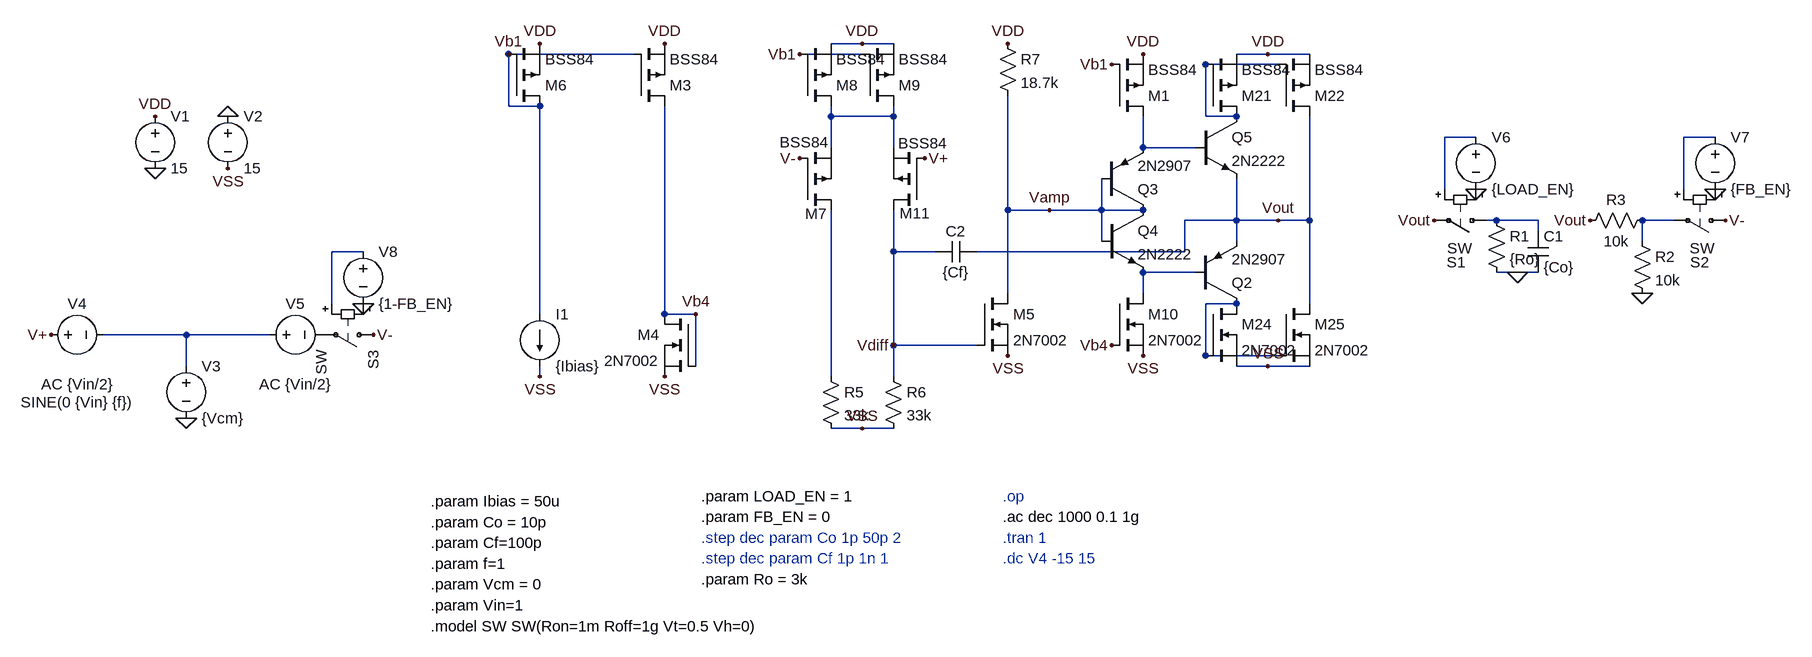
[diagram p0: schematic OpAmp_Project.asc]
OpAmp_Project.asc, the LTspice schematic file:
Version 4
SHEET 1 1828 856
WIRE 384 -64 336 -64
WIRE 432 -64 384 -64
WIRE 32 -48 -160 -48
WIRE 384 -48 288 -48
WIRE 1008 -48 960 -48
WIRE 1072 -48 1008 -48
WIRE 1024 -32 912 -32
WIRE -160 32 -160 -48
WIRE -112 32 -160 32
WIRE 336 48 336 32
WIRE 432 48 432 32
WIRE 432 48 336 48
WIRE 912 48 912 -32
WIRE 960 48 912 48
WIRE 1328 80 1280 80
WIRE 1696 80 1648 80
WIRE 336 96 336 48
WIRE 432 96 432 48
WIRE 816 96 816 48
WIRE 896 96 816 96
WIRE 1280 160 1280 80
WIRE 1648 160 1648 80
WIRE 608 192 608 16
WIRE 672 192 608 192
WIRE 752 192 752 144
WIRE 752 192 672 192
WIRE 816 192 752 192
WIRE 960 208 960 144
WIRE 960 208 880 208
WIRE 1024 208 960 208
WIRE 1072 208 1072 48
WIRE 1072 208 1024 208
WIRE 1360 208 1344 208
WIRE 1424 208 1360 208
WIRE 1632 208 1584 208
WIRE 1424 224 1424 208
WIRE 752 240 752 192
WIRE 960 240 960 208
WIRE 1584 240 1584 208
WIRE -384 256 -432 256
WIRE 432 256 432 192
WIRE 496 256 432 256
WIRE 880 256 880 208
WIRE 880 256 560 256
WIRE 896 288 816 288
WIRE 1392 288 1360 288
WIRE 1424 288 1392 288
WIRE 608 320 608 192
WIRE 816 320 816 288
WIRE -432 336 -432 256
WIRE 960 336 912 336
WIRE 1072 336 1072 208
WIRE -112 352 -112 32
WIRE 80 352 80 32
WIRE 128 352 80 352
WIRE -656 384 -784 384
WIRE -528 384 -656 384
WIRE 432 400 432 256
WIRE 560 400 432 400
WIRE 912 416 912 336
WIRE 1024 416 912 416
WIRE -656 432 -656 384
WIRE 128 432 128 352
WIRE 1008 432 960 432
WIRE 1072 432 1008 432
WIRE -112 448 -112 432
WIRE 336 448 336 192
WIRE 432 448 432 400
WIRE 384 528 336 528
WIRE 432 528 384 528
FLAG -704 128 0
FLAG -704 48 VDD
FLAG -112 -64 VDD
FLAG 384 -64 VDD
FLAG -592 48 0
FLAG -592 128 VSS
FLAG -112 448 VSS
FLAG -864 384 V+
FLAG -656 512 0
FLAG 1008 432 VSS
FLAG 1008 -48 VDD
FLAG 1392 288 0
FLAG 1584 320 0
FLAG 80 448 VSS
FLAG 80 -64 VDD
FLAG -160 -48 Vb1
FLAG 128 352 Vb4
FLAG 816 -48 VDD
FLAG 1024 208 Vout
FLAG 816 416 VSS
FLAG 768 400 Vb4
FLAG 1712 208 V-
FLAG 288 112 V-
FLAG 480 112 V+
FLAG 768 -32 Vb1
FLAG 288 -48 Vb1
FLAG 384 528 VSS
FLAG 608 416 VSS
FLAG 608 -64 VDD
FLAG 432 400 Vdiff
FLAG 672 192 Vamp
FLAG -368 384 V-
FLAG 1264 208 Vout
FLAG -384 336 0
FLAG 1328 160 0
FLAG 1696 160 0
FLAG 1504 208 Vout
SYMBOL current -112 352 R0
WINDOW 123 0 0 Left 0
WINDOW 39 0 0 Left 0
SYMATTR InstName I1
SYMATTR Value {Ibias}
SYMBOL pmos -160 32 M180
SYMATTR InstName M6
SYMATTR Value BSS84
SYMBOL voltage -704 32 R0
WINDOW 123 24 124 Left 2
WINDOW 39 0 0 Left 0
SYMATTR InstName V1
SYMATTR Value 15
SYMBOL pmos 288 32 M180
SYMATTR InstName M8
SYMATTR Value BSS84
SYMBOL pmos 384 32 M180
SYMATTR InstName M9
SYMATTR Value BSS84
SYMBOL voltage -592 32 R0
WINDOW 123 24 124 Left 2
WINDOW 39 0 0 Left 0
SYMATTR InstName V2
SYMATTR Value 15
SYMBOL voltage -656 416 R0
WINDOW 123 24 124 Left 2
WINDOW 39 0 0 Left 0
SYMATTR InstName V3
SYMATTR Value {Vcm}
SYMBOL voltage -880 384 R270
WINDOW 0 32 56 VTop 2
WINDOW 3 -88 56 VBottom 2
WINDOW 123 -60 56 VBottom 2
WINDOW 39 0 0 Left 0
SYMATTR InstName V4
SYMATTR Value SINE(0 {Vin} {f})
SYMATTR Value2 AC {Vin/2}
SYMBOL pnp 896 336 M180
SYMATTR InstName Q2
SYMATTR Value 2N2907
SYMBOL pnp 752 192 M180
SYMATTR InstName Q3
SYMATTR Value 2N2907
SYMBOL npn 752 192 R0
SYMATTR InstName Q4
SYMATTR Value 2N2222
SYMBOL npn 896 48 R0
SYMATTR InstName Q5
SYMATTR Value 2N2222
SYMBOL res 1344 192 R0
SYMATTR InstName R1
SYMATTR Value {Ro}
SYMBOL pmos 912 48 M180
SYMATTR InstName M21
SYMATTR Value BSS84
SYMBOL pmos 1024 48 M180
SYMATTR InstName M22
SYMATTR Value BSS84
SYMBOL nmos 912 336 R0
SYMATTR InstName M24
SYMATTR Value 2N7002
SYMBOL nmos 1024 336 R0
SYMATTR InstName M25
SYMATTR Value 2N7002
SYMBOL cap 1408 224 R0
SYMATTR InstName C1
SYMATTR Value {Co}
SYMBOL res 1568 224 R0
SYMATTR InstName R2
SYMATTR Value 10k
SYMBOL res 1600 192 R90
WINDOW 0 0 56 VBottom 2
WINDOW 3 32 56 VTop 2
SYMATTR InstName R3
SYMATTR Value 10k
SYMBOL pmos 32 32 M180
SYMATTR InstName M3
SYMATTR Value BSS84
SYMBOL nmos 128 352 M0
SYMATTR InstName M4
SYMATTR Value 2N7002
SYMBOL voltage -544 384 R270
WINDOW 0 32 56 VTop 2
WINDOW 3 -88 56 VBottom 2
WINDOW 123 -60 56 VBottom 2
WINDOW 39 0 0 Left 0
SYMATTR InstName V5
SYMATTR Value ""
SYMATTR Value2 AC {Vin/2}
SYMBOL nmos 768 320 R0
SYMATTR InstName M10
SYMATTR Value 2N7002
SYMBOL pmos 768 48 M180
SYMATTR InstName M1
SYMATTR Value BSS84
SYMBOL nmos 560 320 R0
SYMATTR InstName M5
SYMATTR Value 2N7002
SYMBOL res 320 432 R0
SYMATTR InstName R5
SYMATTR Value 33k
SYMBOL res 416 432 R0
SYMATTR InstName R6
SYMATTR Value 33k
SYMBOL res 592 -80 R0
SYMATTR InstName R7
SYMATTR Value 18.7k
SYMBOL pmos 288 192 M180
WINDOW 0 8 -6 Left 2
WINDOW 3 151 103 Left 2
SYMATTR InstName M7
SYMATTR Value BSS84
SYMBOL pmos 480 192 R180
WINDOW 0 -9 -5 Left 2
WINDOW 3 149 104 Left 2
SYMATTR InstName M11
SYMATTR Value BSS84
SYMBOL cap 560 240 R90
WINDOW 0 0 32 VBottom 2
WINDOW 3 32 32 VTop 2
SYMATTR InstName C2
SYMATTR Value {Cf}
SYMBOL sw 1360 208 R90
WINDOW 0 64 77 VLeft 2
WINDOW 3 43 76 VLeft 2
SYMATTR InstName S1
SYMBOL sw 1728 208 R90
WINDOW 0 64 70 VLeft 2
WINDOW 3 43 71 VLeft 2
SYMATTR InstName S2
SYMBOL voltage 1328 64 R0
WINDOW 123 0 0 Left 0
WINDOW 39 0 0 Left 0
SYMATTR InstName V6
SYMATTR Value {LOAD_EN}
SYMBOL voltage 1696 64 R0
WINDOW 123 0 0 Left 0
WINDOW 39 0 0 Left 0
SYMATTR InstName V7
SYMATTR Value {FB_EN}
SYMBOL sw -352 384 R90
SYMATTR InstName S3
SYMBOL voltage -384 240 R0
WINDOW 123 0 0 Left 0
WINDOW 39 0 0 Left 0
SYMATTR InstName V8
SYMATTR Value {1-FB_EN}
TEXT -280 768 Left 2 !.param Vcm = 0
TEXT -280 800 Left 2 !.param Vin=1
TEXT 600 632 Left 2 ;.op
TEXT 600 664 Left 2 !.ac dec 1000 0.1 1g
TEXT 136 696 Left 2 ;.step dec param Co 1p 50p 2
TEXT 600 696 Left 2 ;.tran 1
TEXT -280 736 Left 2 !.param f=1
TEXT 600 728 Left 2 ;.dc V4 -15 15
TEXT -280 640 Left 2 !.param Ibias = 50u
TEXT -280 672 Left 2 !.param Co = 10p
TEXT -280 832 Left 2 !.model SW SW(Ron=1m Roff=1g Vt=0.5 Vh=0)
TEXT 136 632 Left 2 !.param LOAD_EN = 1
TEXT 136 664 Left 2 !.param FB_EN = 0
TEXT 136 760 Left 2 !.param Ro = 3k
TEXT 136 728 Left 2 ;.step dec param Cf 1p 1n 1
TEXT -280 704 Left 2 !.param Cf=100p

The netlist it stands for:
* OpAmp_Project.asc
I1 Vb1 VSS {Ibias}
M6 Vb1 Vb1 VDD VDD BSS84
V1 VDD 0 15
M8 N002 Vb1 VDD VDD BSS84
M9 N002 Vb1 VDD VDD BSS84
V2 0 VSS 15
V3 N011 0 {Vcm}
V4 V+ N011 SINE(0 {Vin} {f}) AC {Vin/2}
Q2 N010 N009 Vout 0 2N2907
Q3 Vamp Vamp N005 0 2N2907
Q4 Vamp Vamp N009 0 2N2222
Q5 N001 N005 Vout 0 2N2222
R1 N006 0 {Ro}
M21 N001 N001 VDD VDD BSS84
M22 Vout N001 VDD VDD BSS84
M24 N010 N010 VSS VSS 2N7002
M25 Vout N010 VSS VSS 2N7002
C1 N006 0 {Co}
R2 N007 0 10k
R3 N007 Vout 10k
M3 Vb4 Vb1 VDD VDD BSS84
M4 Vb4 Vb4 VSS VSS 2N7002
V5 N011 P001 AC {Vin/2}
M10 N009 Vb4 VSS VSS 2N7002
M1 N005 Vb1 VDD VDD BSS84
M5 Vamp Vdiff VSS VSS 2N7002
R5 N012 VSS 33k
R6 Vdiff VSS 33k
R7 VDD Vamp 18.7k
M7 N012 V- N002 N002 BSS84
M11 Vdiff V+ N002 N002 BSS84
C2 Vout Vdiff {Cf}
S1 N006 Vout N003 0 SW
S2 V- N007 N004 0 SW
V6 N003 0 {LOAD_EN}
V7 N004 0 {FB_EN}
S3 V- P001 N008 0 SW
V8 N008 0 {1-FB_EN}
.model NPN NPN
.model PNP PNP
.lib standard.bjt
.model NMOS NMOS
.model PMOS PMOS
.lib standard.mos
.param Vcm = 0
.param Vin=1
* .op
.ac dec 1000 0.1 1g
* .step dec param Co 1p 50p 2
* .tran 1
.param f=1
* .dc V4 -15 15
.param Ibias = 50u
.param Co = 10p
.model SW SW(Ron=1m Roff=1g Vt=0.5 Vh=0)
.param LOAD_EN = 1
.param FB_EN = 0
.param Ro = 3k
* .step dec param Cf 1p 1n 1
.param Cf=100p
.backanno
.end